# EasyEDA Pro project ProPrj_两相交错电源demo_2025-05-26.epro, schematic 降压+采样
Board Name: Board2; Create Date: 2025-03-14; Page Name: P1; Project Name: 两相交错电源demo; Schematic Name: Schematic2; Update Date: 2025-04-10; Company: 嘉立创EDA; Page Size: A4; Version: V1.0
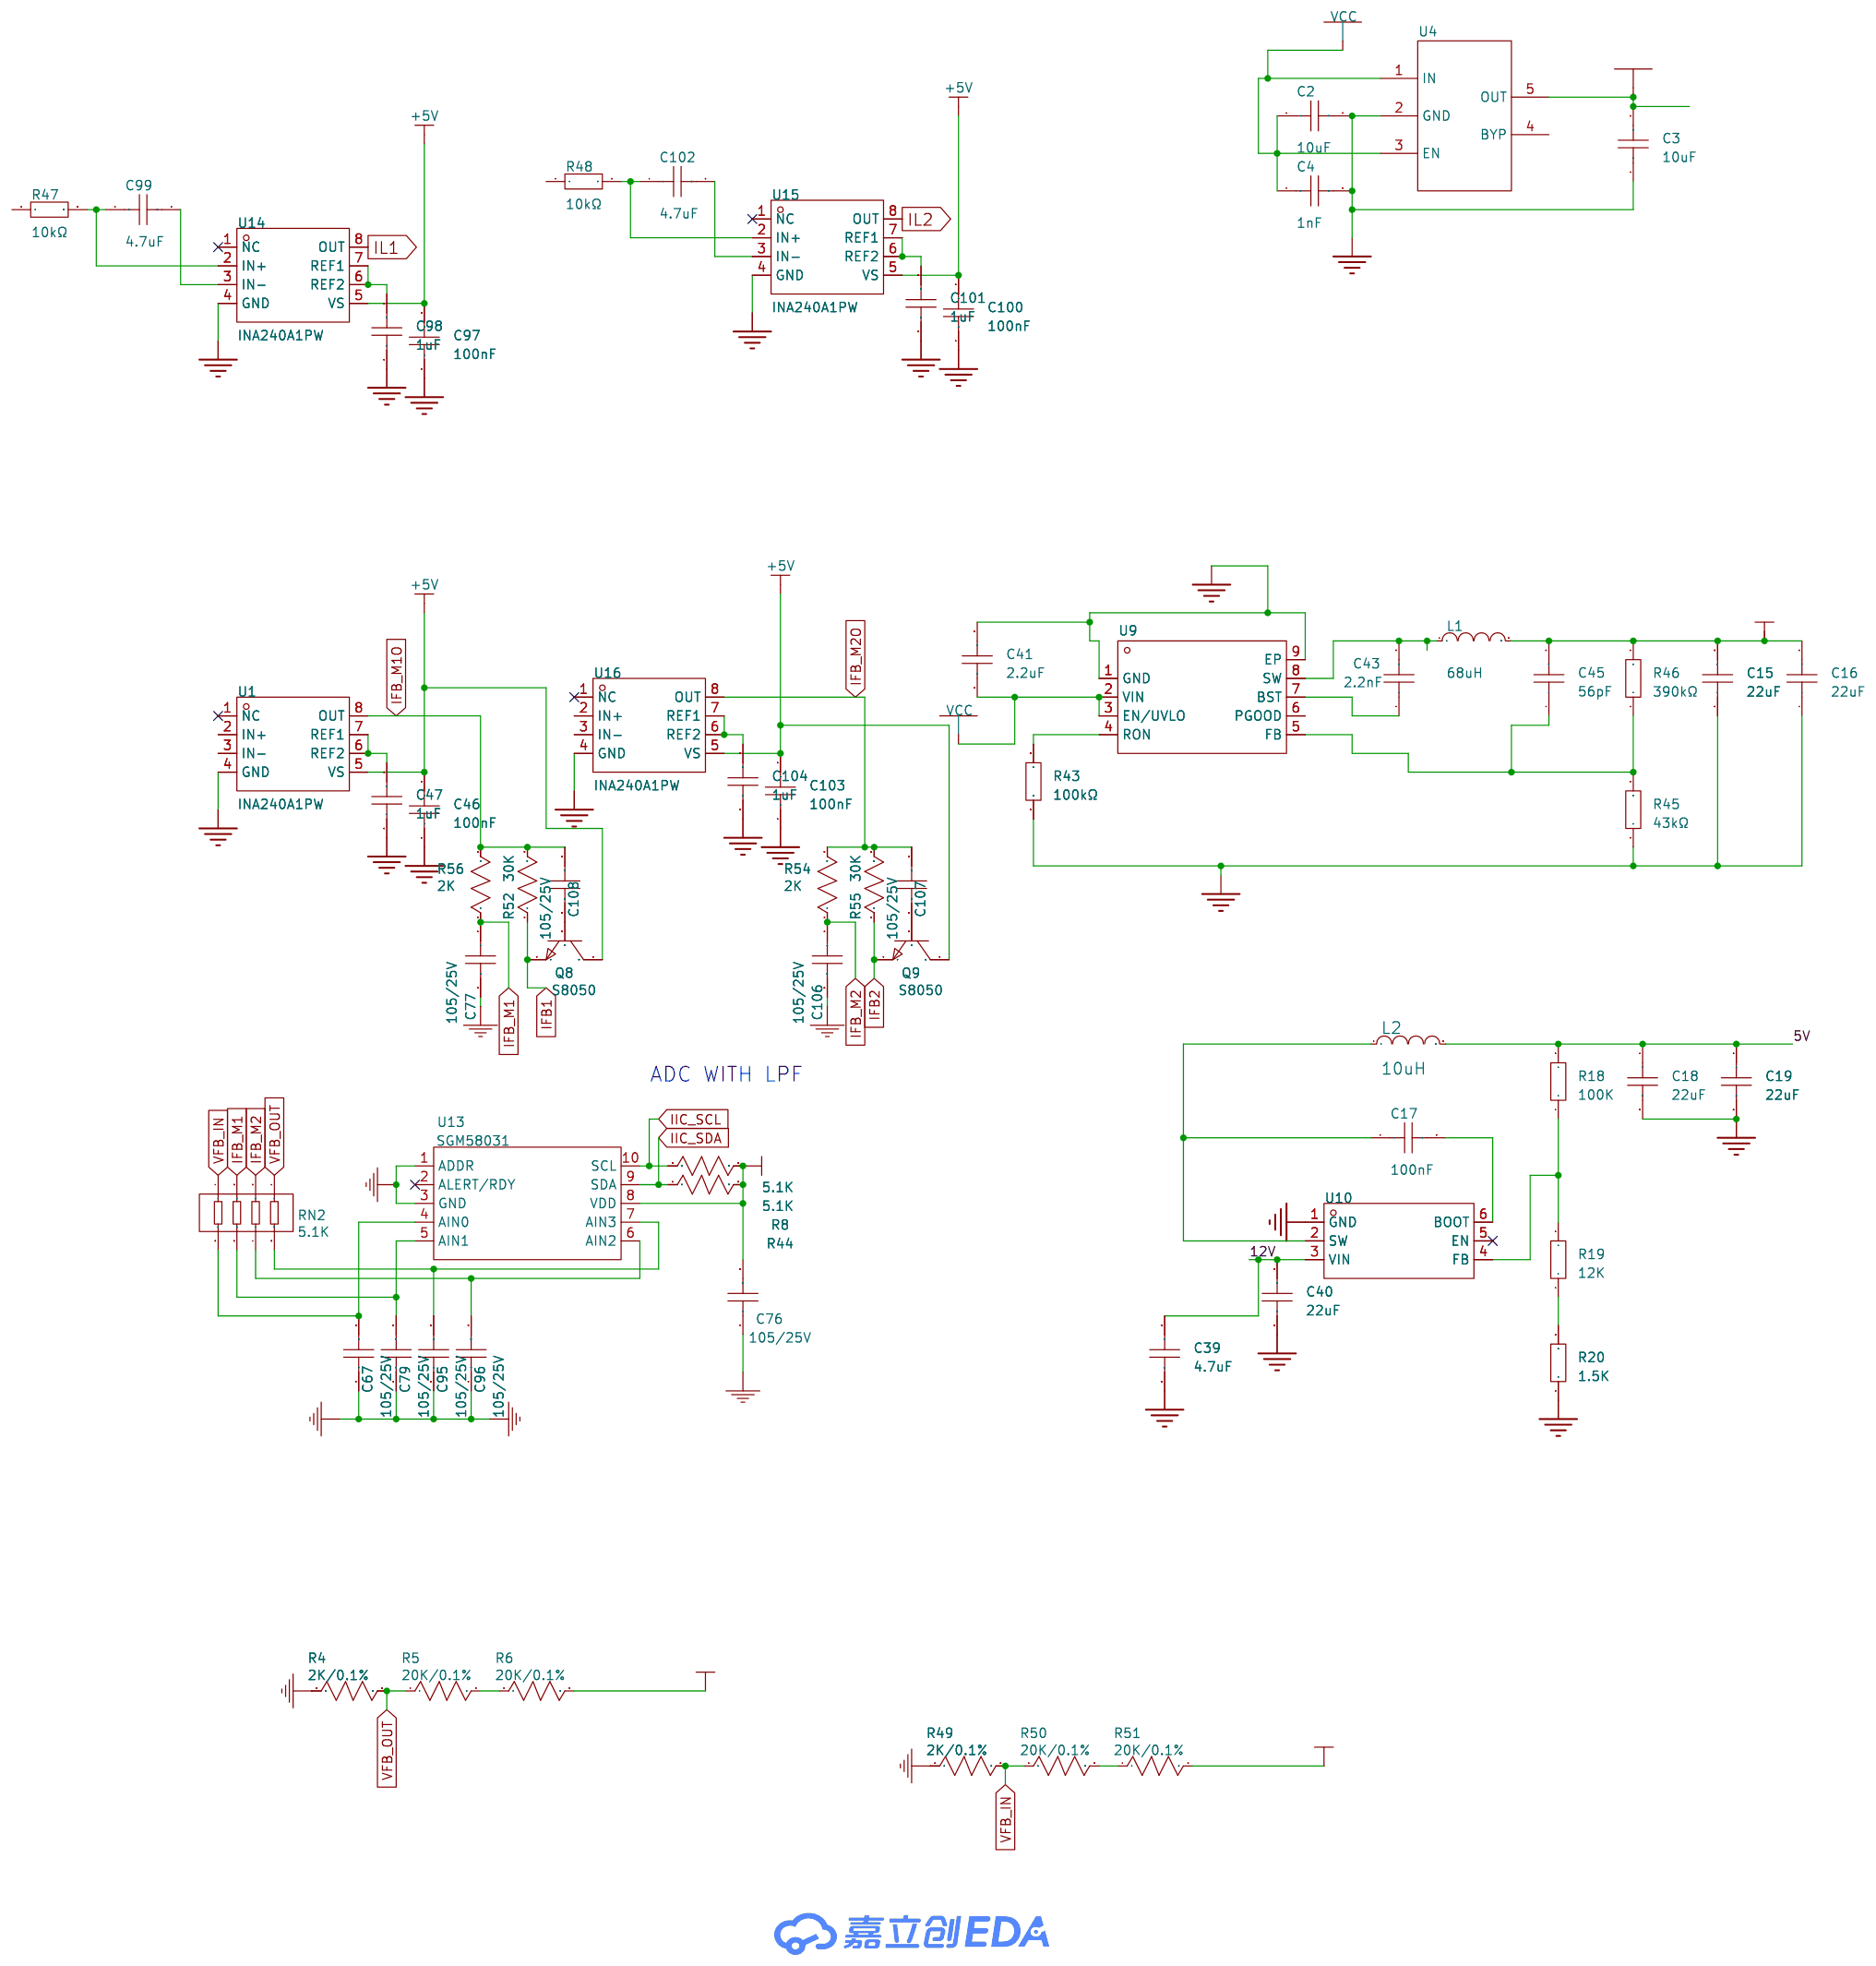
[diagram p6: schematic sheet]

## Parts
C2  10uF  [C0805]
C3  10uF  [C0805]
C4  1nF  [C1206]
C15  22uF  [C0805]
C16  22uF  [C0805]
C17  100nF  [C0603]
C18  22uF  [C0603]
C19  22uF  [C0603]
C39  4.7uF  [C0603]
C40  22uF  [C0805]
C41  2.2uF  [C0805]
C43  2.2nF  [C0603]
C45  56pF  [C0603]
C46  100nF  [C0603]
C47  1uF  [C0603]
C67  105/25V  [C0603]
C76  105/25V  [C0603]
C77  105/25V  [C0603]
C79  105/25V  [C0603]
C95  105/25V  [C0603]
C96  105/25V  [C0603]
C97  100nF  [C0603]
C98  1uF  [C0603]
C99  4.7uF  [C0805]
C100  100nF  [C0603]
C101  1uF  [C0603]
C102  4.7uF  [C0805]
C103  100nF  [C0603]
C104  1uF  [C0603]
C106  105/25V  [C0603]
C107  105/25V  [C0603]
C108  105/25V  [C0603]
L1  68uH  [IND-SMD_L7.1-W6.6-1]
L2  10uH  [IND-SMD_L5.4-W5.2_FXL0530]
Q8  S8050  [SOT-23-3_L2.9-W1.3-P1.90-LS2.4-TR]
Q9  S8050  [SOT-23-3_L2.9-W1.3-P1.90-LS2.4-TR]
R4  2K/0.1%  [R0603]
R5  20K/0.1%  [R0603]
R6  20K/0.1%  [R0603]
R8  5.1K  [R0603]
R18  100K  [R0603]
R19  12K  [R0603]
R20  1.5K  [R0603]
R43  100kΩ  [R0603]
R44  5.1K  [R0603]
R45  43kΩ  [R0603]
R46  390kΩ  [R0603]
R47  10kΩ  [R0805]
R48  10kΩ  [R0805]
R49  2K/0.1%  [R0603]
R50  20K/0.1%  [R0603]
R51  20K/0.1%  [R0603]
R52  30K  [R0603]
R54  2K  [R0603]
R55  30K  [R0603]
R56  2K  [R0603]
RN2  5.1K  [RES-ARRAY-SMD_0603-8P-L3.2-W1.6-BL]
U1  INA240A1PW  [TSSOP-8_L4.4-W3.0-P0.65-LS6.4-TL]
U4  -  [SOT-23-5_L3.0-W1.7-P0.95-LS2.8-TL]
U9  -  [SO-8_L4.9-W3.9-P1.27-LS6.0-BL-EP]
U10  TPS54302DDCR  [SOT-23-6_L2.9-W1.6-P0.95-LS2.8-BL]
U13  SGM58031  [MSOP-10_L3.0-W3.0-P0.50-LS5.0-BR]
U14  INA240A1PW  [TSSOP-8_L4.4-W3.0-P0.65-LS6.4-TL]
U15  INA240A1PW  [TSSOP-8_L4.4-W3.0-P0.65-LS6.4-TL]
U16  INA240A1PW  [TSSOP-8_L4.4-W3.0-P0.65-LS6.4-TL]

## Library data of the parts
C2 C3 = C0805S102K1RAC7800: 容值:1nF;精度:±10%;额定电压:100V;温度系数:X7R;; LCSC Part Name: 1nF ±10% 100V; Supplier Part: C141167; Manufacturer: KEMET(基美); Supplier Footprint: 0805; Datasheet: https://atta.szlcsc.com/upload/public/pdf/source/20171201/C141167_15121177000921156234.pdf; Supplier: LCSC; Tolerance: ±10%; Voltage Rated: 100V; Temperature Coefficient: X7R
C4 = 1206B102K202: 容值:1nF;精度:±10%;额定电压:2kV;温度系数:X7R;; LCSC Part Name: 1nF ±10% 2kV; Supplier Part: C77494; Manufacturer: 华新科(Walsin); Supplier Footprint: 1206; Datasheet: https://atta.szlcsc.com/upload/public/pdf/source/20180823/C77494_920E960ED59230C79654B6B7895D893E.pdf; Supplier: LCSC; Tolerance: ±10%; Voltage Rated: 2kV; Temperature Coefficient: X7R
C15 C16 = CL21A226MAQNNNE_C45783: 容值:22uF;精度:±20%;额定电压:25V;材质(温度系数):X5R;; LCSC Part Name: 22uF ±20% 25V; Supplier Part: C45783; Manufacturer: SAMSUNG(三星); Manufacturer Part: CL21A226MAQNNNE; Supplier Footprint: 0805; JLCPCB Part Class: 基础库; Datasheet: https://atta.szlcsc.com/upload/public/pdf/source/20160103/1457707727161.pdf; Supplier: LCSC; Tolerance: ±20%; Voltage Rated: 25V; Temperature Coefficient: X5R
C17 = CAP_0402: Supplier Footprint: 0402
C18 C19 = CL10A226MQ8NRNC: 容值:22uF;精度:±20%;额定电压:6.3V;材质(温度系数):X5R;; LCSC Part Name: 22uF ±20% 6.3V; Supplier Part: C59461; Manufacturer: SAMSUNG(三星); Supplier Footprint: 0603; JLCPCB Part Class: 基础库; Datasheet: https://atta.szlcsc.com/upload/public/pdf/source/20160103/1457707740762.pdf; Supplier: LCSC; Tolerance: ±20%; Voltage Rated: 6.3V; Temperature Coefficient: X5R
C39 = CGA0603X5R475K160JT: 容值:4.7uF;精度:±10%;额定电压:16V;材质(温度系数):X5R;; LCSC Part Name: 4.7uF ±10% 16V; Supplier Part: C6119855; Manufacturer: HRE(芯声); Supplier Footprint: 0603; JLCPCB Part Class: Extended Part; Supplier: LCSC; Tolerance: ±10%; Voltage Rated: 16V; Temperature Coefficient: X5R
C40 = CL21A226MOQNNNE: 容值:22uF;精度:±20%;额定电压:16V;材质(温度系数):X5R;; LCSC Part Name: 22uF ±20% 16V; Supplier Part: C98190; Manufacturer: SAMSUNG(三星); Supplier Footprint: 0805; JLCPCB Part Class: Extended Part; Datasheet: https://atta.szlcsc.com/upload/public/pdf/source/20160218/1457707763339.pdf; Supplier: LCSC; Tolerance: ±20%; Voltage Rated: 16V; Temperature Coefficient: X5R
C41 = HHV0805R7225K101NSLJ: 容值:2.2uF;精度:±10%;额定电压:100V;材质(温度系数):X7R;; LCSC Part Name: 2.2uF ±10% 100V; Supplier Part: C22367838; Manufacturer: Chinocera(华瓷); Supplier Footprint: 0805; JLCPCB Part Class: Extended Part; Datasheet: https://atta.szlcsc.com/upload/public/pdf/source/20240326/047A46E16B3E574E3E72A3B6624FA886.pdf; Supplier: LCSC; Tolerance: ±10%; Voltage Rated: 100V; Temperature Coefficient: X7R
C43 = C0603X5R106M160NT: 容值:10uF;精度:±20%;额定电压:16V;温度系数:X5R;; LCSC Part Name: 10uF ±20% 16V; Supplier Part: C466781; Manufacturer: SANYEAR(叁叶源); Supplier Footprint: 0603; Datasheet: https://atta.szlcsc.com/upload/public/pdf/source/20191209/C466781_7B1C97983691E173DFF63AE7A9C35A8A.pdf; Supplier: LCSC; Tolerance: ±20%; Voltage Rated: 16V; Temperature Coefficient: X5R
C45 = 0603N560J500CT: 容值:56pF;精度:±5%;额定电压:50V;材质(温度系数):NP0;; LCSC Part Name: 56pF ±5% 50V; Supplier Part: C302071; Manufacturer: Walsin(华新科); Supplier Footprint: 0603; JLCPCB Part Class: Extended Part; Datasheet: https://atta.szlcsc.com/upload/public/pdf/source/20191217/C469650_84AD5C6F618CF4AC0C6D987F2E8FE6F8.pdf; Supplier: LCSC; Tolerance: ±5%; Voltage Rated: 50V; Temperature Coefficient: NP0
C46 C47 C97 C98 C100 C101 C103 C104 = CC0603KRX7R9BB104: 容值:100nF;精度:±10%;额定电压:50V;材质(温度系数):X7R;; LCSC Part Name: 100nF ±10% 50V; Supplier Part: C14663; Manufacturer: YAGEO(国巨); Supplier Footprint: 0603; JLCPCB Part Class: 基础库; Datasheet: https://atta.szlcsc.com/upload/public/pdf/source/20180910/C282072_33301C7F631E79921B82A8DAC6BCC5B3.pdf; Supplier: LCSC; Tolerance: ±10%; Voltage Rated: 50V; Temperature Coefficient: X7R
C67 C76 C77 C79 C95 C96 C106-C108 = 105/25V: Supplier: LCSC
C99 C102 = CGA0805X7R475K350MT: 容值:4.7uF;精度:±10%;额定电压:35V;材质(温度系数):X7R;; LCSC Part Name: 4.7uF ±10% 35V; Supplier Part: C6119943; Manufacturer: HRE(芯声); Supplier Footprint: 0805; JLCPCB Part Class: 扩展库; Supplier: LCSC; Tolerance: ±10%; Voltage Rated: 35V; Temperature Coefficient: X7R
L1 = PSPMAA0605H-680M-IGF: 电感值:68uH;精度:±20%;额定电流:2A;饱和电流(Isat):2.5A;; LCSC Part Name: 68uH ±20% 2.5A; Supplier Part: C2983094; Manufacturer: PROD(谱罗德); Supplier Footprint: SMD,6.6x7.1mm; JLCPCB Part Class: 扩展库; Datasheet: https://atta.szlcsc.com/upload/public/pdf/source/20220421/FA7B36985F5EDDBED7850D2E38F6BF27.pdf; Supplier: LCSC; Tolerance: ±20%; Rated Current: 2A; Saturation Current (Isat): 2.5A; DC Resistance (DCR): 256mΩ; Ratings: AEC-Q200
L2 = FXL0530-100-M: 电感值:10uH;精度:±20%;额定电流:3.2A;饱和电流(Isat):3.5A;; LCSC Part Name: 10uH ±20% 3.2A 110mΩ; Supplier Part: C177248; Manufacturer: cjiang(长江微电); Supplier Footprint: SMD,5.4x5.2x2.8mm; JLCPCB Part Class: 扩展库; Supplier: LCSC; Tolerance: ±20%; Rated Current: 3.2A; Saturation Current (Isat): 3.5A; DC Resistance (DCR): 110mΩ
Q8 Q9 = S8050: Supplier: LCSC; JLCPCB Part Class: SOT-23
R4 R49 = 2K/0.1%: Supplier: LCSC
R5 R6 R50 R51 = 20K/0.1%: Supplier: LCSC
R8 R44 RN2 = 5.1K: Supplier: LCSC
R18-R20 = Res_0402: Supplier Footprint: 0402
R43 = 0603WAF1603T5E: 电阻类型:厚膜电阻;阻值:160kΩ;精度:±1%;功率:1/10W;温度系数:±100ppm/;最大工作电压:75V;工作温度范围:-55~+155;; LCSC Part Name: 160kΩ ±1%; Supplier Part: C22813; Manufacturer: UNI-ROYAL(厚声); Supplier Footprint: 0603; Datasheet: https://atta.szlcsc.com/upload/public/pdf/source/20200306/C422600_1E6D84923E4A46A82E41ADD87F860B5C.pdf; Supplier: LCSC; Type: 厚膜电阻; Tolerance: ±1%; Power(Watts): 1/10W; Temperature Coefficient: ±100ppm/; Overload Voltage (Max): 75V; Operating Temperature Range: -55~+155
R45 = CR0603F43K0P05Z: 电阻类型:厚膜电阻;阻值:43kΩ;精度:±1%;功率:100mW;温度系数:±100ppm/℃;; LCSC Part Name: 厚膜电阻 43kΩ ±1% 100mW; Supplier Part: C881064; Manufacturer: EVER OHMS(天二科技); Supplier Footprint: 0603; JLCPCB Part Class: Extended Part; Datasheet: https://atta.szlcsc.com/upload/public/pdf/source/20201014/C881429_ABC29D63C8D6A11EB63D87348B25AA7B.pdf; Supplier: LCSC; Type: 厚膜电阻; Tolerance: ±1%; Power(Watts): 100mW; Temperature Coefficient: ±100ppm/℃; Operating Temperature Range: -55℃~+155℃
R46 = RS-03K3903FT: 电阻类型:厚膜电阻;阻值:390kΩ;精度:±1%;功率:100mW;最大工作电压:50V;温度系数:±100ppm/℃;; LCSC Part Name: 厚膜电阻 390kΩ ±1% 100mW; Supplier Part: C310278; Manufacturer: FH(风华); Supplier Footprint: 0603; JLCPCB Part Class: Extended Part; Datasheet: https://atta.szlcsc.com/upload/public/pdf/source/20140616/1457707091974.pdf; Supplier: LCSC; Type: 厚膜电阻; Tolerance: ±1%; Power(Watts): 100mW; Overload Voltage (Max): 50V; Temperature Coefficient: ±100ppm/℃; Operating Temperature Range: -55℃~+155℃
R47 R48 = 0805W8F1002T5E_C17414: 电阻类型:厚膜电阻;阻值:10kΩ;精度:±1%;功率:125mW;最大工作电压:150V;温度系数:±100ppm/℃;; LCSC Part Name: 10kΩ ±1% 125mW 厚膜电阻; Supplier Part: C17414; Manufacturer: UNI-ROYAL(厚声); Manufacturer Part: 0805W8F1002T5E; Supplier Footprint: 0805; Datasheet: https://atta.szlcsc.com/upload/public/pdf/source/20200306/C422600_1E6D84923E4A46A82E41ADD87F860B5C.pdf; Supplier: LCSC; Type: 厚膜电阻; Tolerance: ±1%; Power(Watts): 125mW; Overload Voltage (Max): 150V; Temperature Coefficient: ±100ppm/℃; Operating Temperature Range: -55℃~+155℃
R52 R55 = 30K: Supplier: LCSC
R54 R56 = 2K: Supplier: LCSC
U1 U14-U16 = INA240A1PW: 放大器数:单路;; Supplier Part: C1346518; Manufacturer: TI(德州仪器); Supplier Footprint: TSSOP-8; JLCPCB Part Class: 扩展库; Datasheet: https://www.ti.com/cn/lit/gpn/ina2180; Supplier: LCSC; Number of Channels: 单路; Supply Current: 1.8mA; Operating Temperature: -40℃~+125℃
U4 = SPX3819M5-L-5-0/TR: 输出类型:固定;输出极性:正;输出通道数:1;最大输入电压:16V;输出电压:5V;压差:700mV@(500mA);输出电流:500mA;电源纹波抑制比(PRSS):-;; LCSC Part Name: Vin=16V Vout=5V 500mA; Supplier Part: C13417; Manufacturer: MaxLinear; Supplier Footprint: SOT-23-5; Datasheet: https://atta.szlcsc.com/upload/public/pdf/source/20150720/1457707331934.pdf; Supplier: LCSC; Output Type: 固定; Output Polarity: 正; Number of Outputs: 1; Maximum Input Voltage: 16V; Output Voltage: 5V; Dropout Voltage: 700mV@(500mA); Output Current: 500mA
U9 = LM5164DDAR: 功能类型:降压型;同步整流:-;输出通道数:-;拓扑结构:-;输入电压:-;输出电流(最大值):-;开关频率:-;; LCSC Part Name: 降压型; Supplier Part: C477928; Manufacturer: TI(德州仪器); Supplier Footprint: SO-8; Datasheet: https://atta.szlcsc.com/upload/public/pdf/source/20200102/C477928_A6130A40DCA2C193067E68A47DE8CF0C.pdf; Supplier: LCSC; Function: 降压型
U10 = TPS54302DDCR: 功能类型:降压型;输出类型:可调;输入电压:4.5V~28V;输出电压:596mV~28V;输出电流(最大值):3A;; LCSC Part Name: 降压型 输入4.5V~28V 输出596mV~28V 3A; Supplier Part: C311983; Manufacturer: TI(德州仪器); Supplier Footprint: TSOT-23-6; JLCPCB Part Class: 扩展库; Datasheet: https://atta.szlcsc.com/upload/public/pdf/source/20181023/C311983_0948EE70BFAD2011B492BD3F4CEA709D.pdf; Supplier: LCSC; Function: 降压型; Synchronous Rectification: 是; Output Type: 可调; Number of Outputs: 1; Topology: 降压式; Input Voltage: 4.5V~28V; Output Voltage: 596mV~28V; Output Current (Max): 3A; Switching Frequency: 400kHz; Operating Temperature: -40℃~+125℃@(TJ)
U13 = SGM58031: Supplier: LCSC; image: //image.lceda.cn/szlcsc/C37593.jpg; JLCPCB Part Class: Extend; JLCPCB SMD: Yes

## Nets
5V: C18.1 C19.1 L2.2 R18.2
12V: C15.2 C16.2 C39.1 C40.1 C45.2 L1.2 R46.2 U10.3(VIN)
+3.3V: C3.2 C76.2 R8.2 R44.2 U4.5(OUT) U13.8(VDD)
+5V: C46.2 C97.2 C100.2 C103.2 Q8.3(C) Q9.3(C) U1.5(VS) U14.5(VS) U15.5(VS) U16.5(VS)
GND: C2.2 C3.1 C4.2 C15.1 C16.1 C18.2 C19.2 C39.2 C40.2 C41.2 C46.1 C47.1 C67.1 C76.1 C77.2 C79.1 C95.1 C96.1 C97.1 C98.1 C100.1 C101.1 C103.1 C104.1 C106.2 R4.1 R20.1 R43.1 R45.1 R49.1 U1.4(GND) U4.2(GND) U9.1(GND) U9.9(EP) U10.1(GND) U13.1(ADDR) U13.3(GND) U14.4(GND) U15.4(GND) U16.4(GND)
VCC: C2.1 C4.1 C41.1 R51.2 U4.1(IN) U4.3(EN) U9.2(VIN) U9.3(EN/UVLO)
IFB1: Q8.1(E) R52.1
IFB2: Q9.1(E) R55.1
IFB_M1: C77.1 R56.1 RN2.3
IFB_M1O: C108.1 R52.2 R56.2 U1.8(OUT)
IFB_M2: C106.1 R54.1 RN2.2
IFB_M2O: C107.1 R54.2 R55.2 U16.8(OUT)
IIC_SCL: R8.1 U13.10(SCL)
IIC_SDA: R44.1 U13.9(SDA)
IL1: U14.8(OUT)
IL2: U15.8(OUT)
VFB_IN: R49.2 R50.1 RN2.4
VFB_OUT: R4.2 R5.1 RN2.1
VOUT: R6.2
$1N1188: C43.2 L1.1 U9.8(SW)
$1N1189: C43.1 U9.7(BST)
$1N1190: C45.1 R45.2 R46.1 U9.5(FB)
$1N1194: R43.2 U9.4(RON)
$1N1584: C17.1 L2.1 U10.2(SW)
$1N1585: C17.2 U10.6(BOOT)
$1N1588: R19.1 R20.2
$1N1594: R18.1 R19.2 U10.4(FB)
$1N2149: C47.2 U1.6(REF2) U1.7(REF1)
$1N3839: C96.2 RN2.7 U13.6(AIN2)
$1N3840: C95.2 RN2.8 U13.7(AIN3)
$1N3841: C79.2 RN2.6 U13.5(AIN1)
$1N3849: C67.2 RN2.5 U13.4(AIN0)
$1N4786: C98.2 U14.6(REF2) U14.7(REF1)
$1N4972: C99.1 R47.2 U14.2(IN+)
$1N5061: C99.2 U14.3(IN-)
$1N5312: C101.2 U15.6(REF2) U15.7(REF1)
$1N5314: C102.1 R48.2 U15.2(IN+)
$1N5319: C102.2 U15.3(IN-)
$1N5501: C104.2 U16.6(REF2) U16.7(REF1)
$1N5604: R5.2 R6.1
$1N5700: R50.2 R51.1
$1N6423: C107.2 Q9.2(B)
$1N6584: C108.2 Q8.2(B)

Not connected (* = marked no-connect by the designer): R47 1; R48 1; U1 1(NC)* 2(IN+) 3(IN-); U4 4(BYP); U9 6(PGOOD); U10 5(EN)*; U13 2(ALERT/RDY)*; U14 1(NC)*; U15 1(NC)*; U16 1(NC)* 2(IN+) 3(IN-)

## Notes on the sheet
- ADC WITH LPF
